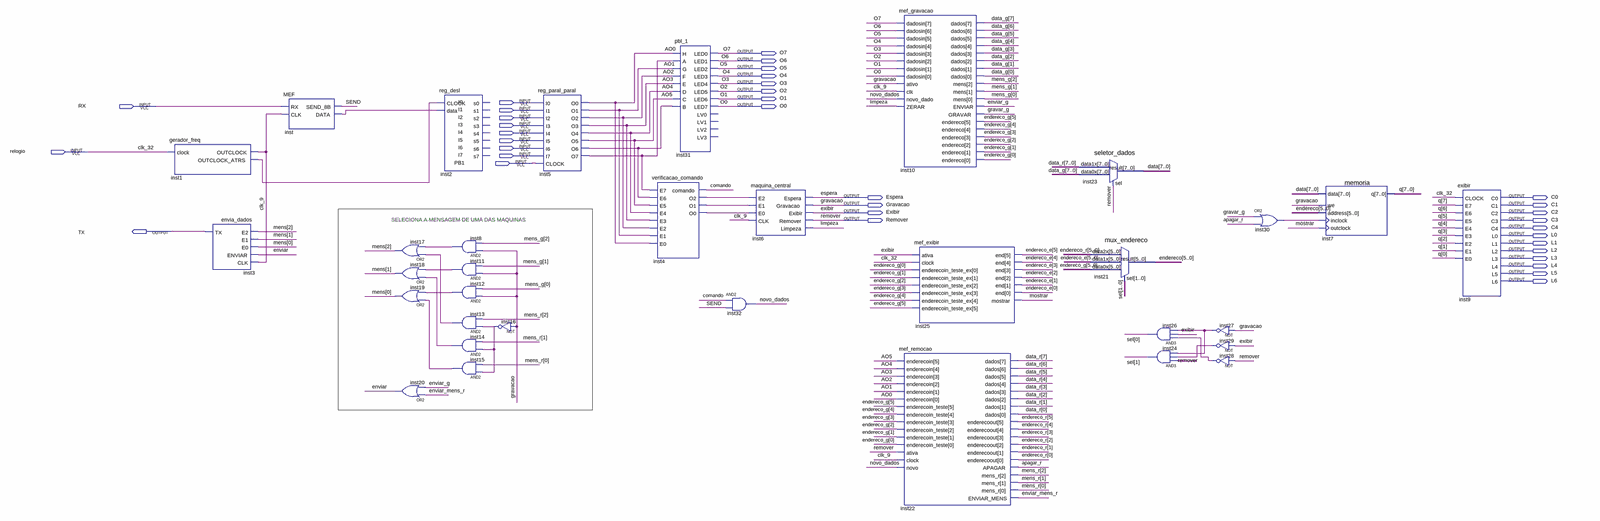
[diagram p0: schematic sheet, whole]
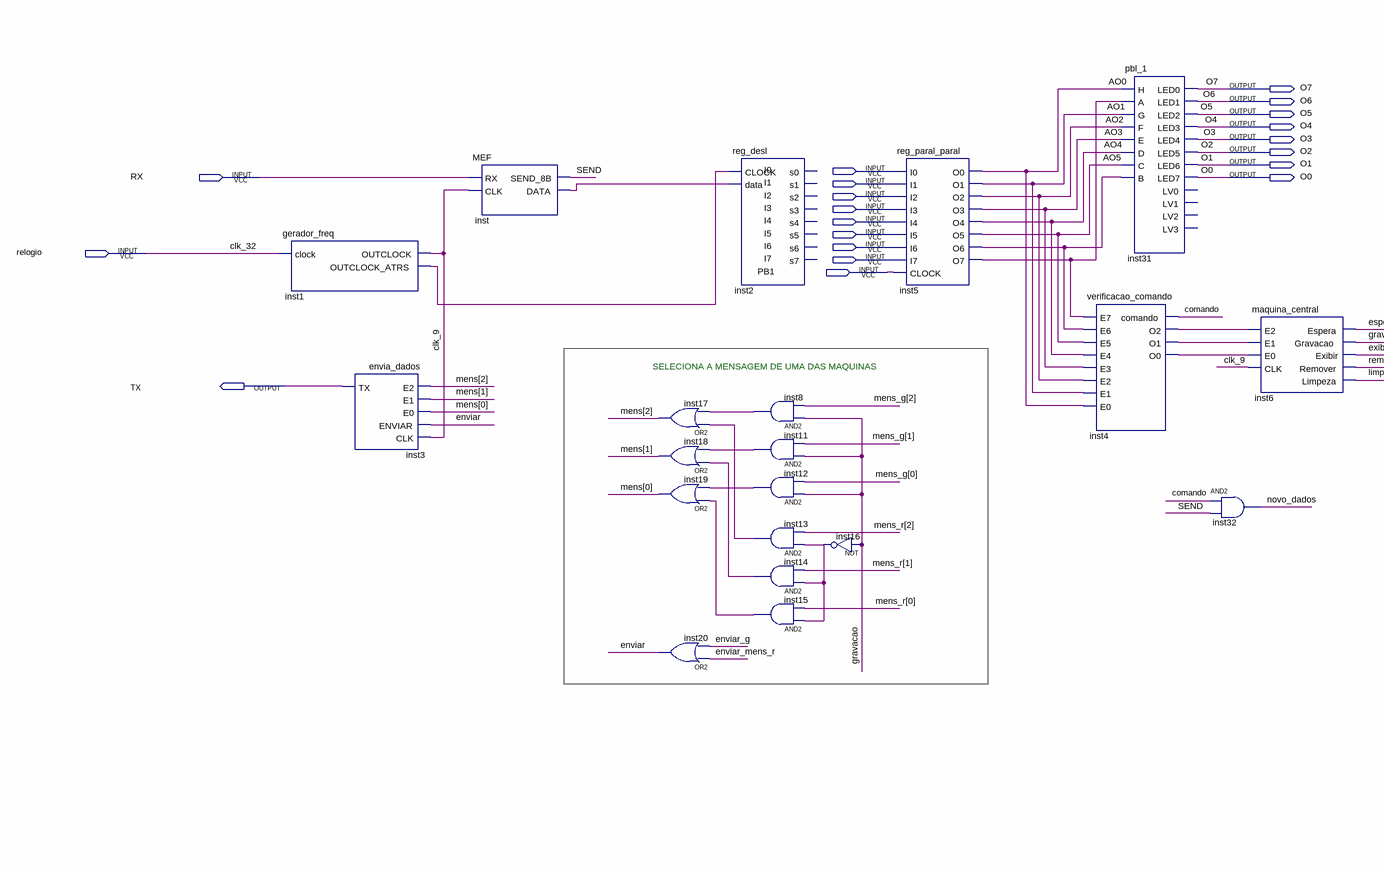
[diagram p1: schematic sheet, left part]
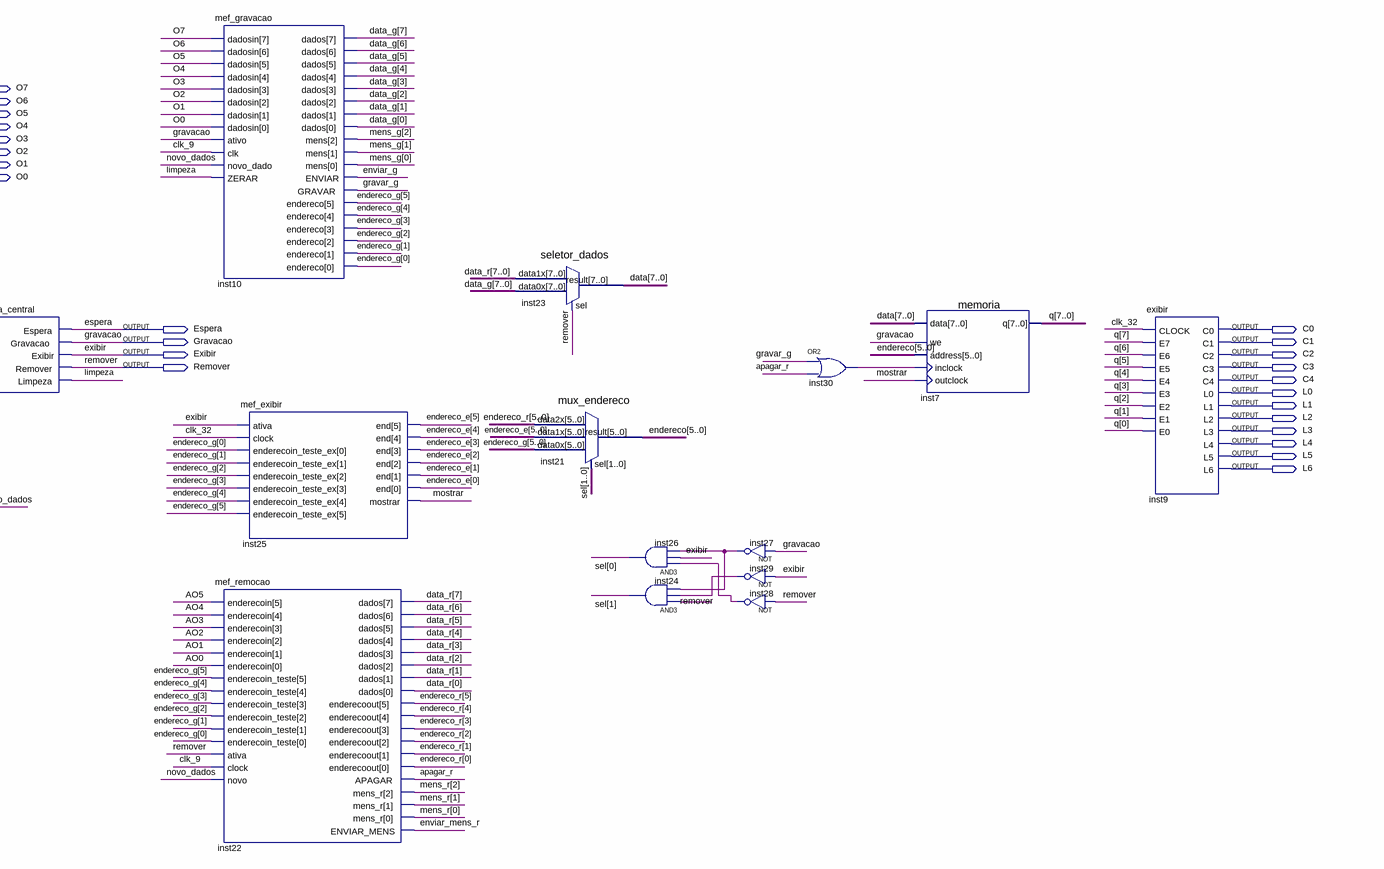
[diagram p2: schematic sheet, right part]
// Quartus schematic PBL3.bdf as structural Verilog: 33 symbols, 36 pins
module PBL3 (
  input  I0,
  input  RX,
  input  I1,
  input  I2,
  input  I3,
  input  I4,
  input  I5,
  input  I6,
  input  relogio,
  input  I7,
  input  PB1,
  output O7,
  output O6,
  output O5,
  output O4,
  output O3,
  output O2,
  output O1,
  output O0,
  output Espera,
  output C0,
  output Gravacao,
  output C1,
  output Exibir,
  output C2,
  output Remover,
  output C3,
  output C4,
  output TX,
  output L0,
  output L1,
  output L2,
  output L3,
  output L4,
  output L5,
  output L6
);

  wire AO0, AO1, AO2, AO3, AO4, AO5, apagar_r, clk_9, comando, enviar, enviar_g, enviar_mens_r, gravar_g,
       inst1_outclock_atrs, inst4_o0, inst4_o1, inst4_o2, inst5_o6, inst5_o7, inst8_out, inst11_out,
       inst12_out, inst13_out, inst14_out, inst15_out, inst16_out, inst27_out, inst28_out, inst29_out,
       inst30_out, inst_data, limpeza, mostrar, novo_dados, SEND;
  wire [1:0] sel;
  wire [2:0] mens, mens_g, mens_r;
  wire [5:0] endereco, endereco_e, endereco_g, endereco_r;
  wire [7:0] data, data_g, data_r, q;

  gerador_freq inst1 (.clock(relogio), .OUTCLOCK(clk_9), .OUTCLOCK_ATRS(inst1_outclock_atrs));
  envia_dados inst3 (.E2(mens[2]), .E1(mens[1]), .E0(mens[0]), .ENVIAR(enviar), .CLK(clk_9), .TX(TX));
  MEF inst (.RX(RX), .CLK(clk_9), .SEND_8B(SEND), .DATA(inst_data));
  or inst17 (mens[2], inst13_out, inst8_out);
  or inst18 (mens[1], inst14_out, inst11_out);
  or inst19 (mens[0], inst15_out, inst12_out);
  or inst20 (enviar, enviar_mens_r, enviar_g);
  reg_desl inst2 (.CLOCK(inst1_outclock_atrs), .data(inst_data));  // open: s0, s1, s2, s3, s4, s5, s6, s7
  and inst8 (inst8_out, Gravacao, mens_g[2]);
  and inst11 (inst11_out, Gravacao, mens_g[1]);
  and inst12 (inst12_out, Gravacao, mens_g[0]);
  and inst13 (inst13_out, inst16_out, mens_r[2]);
  and inst14 (inst14_out, inst16_out, mens_r[1]);
  and inst15 (inst15_out, inst16_out, mens_r[0]);
  not inst16 (inst16_out, Gravacao);
  reg_paral_paral inst5 (
    .I0(I0), .I1(I1), .I2(I2), .I3(I3), .I4(I4), .I5(I5), .I6(I6), .I7(I7), .CLOCK(PB1), .O0(AO0), .O1(AO1),
    .O2(AO2), .O3(AO3), .O4(AO4), .O5(AO5), .O6(inst5_o6), .O7(inst5_o7));
  pbl_1 inst31 (
    .H(AO0), .A(inst5_o7), .G(AO1), .F(AO2), .E(AO3), .D(AO4), .C(AO5), .B(inst5_o6), .LED0(O7), .LED1(O6),
    .LED2(O5), .LED3(O4), .LED4(O3), .LED5(O2), .LED6(O1), .LED7(O0));  // open: LV0, LV1, LV2, LV3
  verificacao_comando inst4 (
    .E7(inst5_o7), .E6(inst5_o6), .E5(AO5), .E4(AO4), .E3(AO3), .E2(AO2), .E1(AO1), .E0(AO0),
    .comando(comando), .O2(inst4_o2), .O1(inst4_o1), .O0(inst4_o0));
  and inst32 (novo_dados, comando, SEND);
  maquina_central inst6 (
    .E2(inst4_o2), .E1(inst4_o1), .E0(inst4_o0), .CLK(clk_9), .Espera(Espera), .Gravacao(Gravacao),
    .Exibir(Exibir), .Remover(Remover), .Limpeza(limpeza));
  mef_gravacao inst10 (
    .dadosin({O7, O6, O5, O4, O3, O2, O1, O0}), .ativo(Gravacao), .clk(clk_9), .novo_dado(novo_dados),
    .ZERAR(limpeza), .dados(data_g), .mens(mens_g), .ENVIAR(enviar_g), .GRAVAR(gravar_g),
    .endereco(endereco_g));
  mef_exibir inst25 (
    .ativa(Exibir), .clock(relogio), .enderecoin_teste_ex(endereco_g), .\end (endereco_e), .mostrar(mostrar));
  mef_remocao inst22 (
    .enderecoin({AO5, AO4, AO3, AO2, AO1, AO0}), .enderecoin_teste(endereco_g), .ativa(Remover),
    .clock(clk_9), .novo(novo_dados), .dados(data_r), .enderecoout(endereco_r), .APAGAR(apagar_r),
    .mens_r(mens_r), .ENVIAR_MENS(enviar_mens_r));
  seletor_dados inst23 (.data1x(data_r), .data0x(data_g), .sel(Remover), .result(data));
  mux_endereco inst21 (.data2x(endereco_r), .data1x(endereco_e), .data0x(endereco_g), .sel(sel), .result(endereco));
  and inst26 (sel[0], inst28_out, Exibir, inst27_out);
  and inst24 (sel[1], Remover, inst29_out, inst27_out);
  not inst27 (inst27_out, Gravacao);
  not inst29 (inst29_out, Exibir);
  not inst28 (inst28_out, Remover);
  or inst30 (inst30_out, gravar_g, apagar_r);
  memoria inst7 (.data(data), .we(Gravacao), .address(endereco), .inclock(inst30_out), .outclock(mostrar), .q(q));
  exibir inst9 (
    .CLOCK(relogio), .E7(q[7]), .E6(q[6]), .E5(q[5]), .E4(q[4]), .E3(q[3]), .E2(q[2]), .E1(q[1]), .E0(q[0]),
    .C0(C0), .C1(C1), .C2(C2), .C3(C3), .C4(C4), .L0(L0), .L1(L1), .L2(L2), .L3(L3), .L4(L4), .L5(L5), .L6(L6));

  // Other names for the same wires on the sheet: clk_32 = relogio

  // Notes on the sheet:
  //   SELECIONA A MENSAGEM DE UMA DAS MAQUINAS
endmodule
